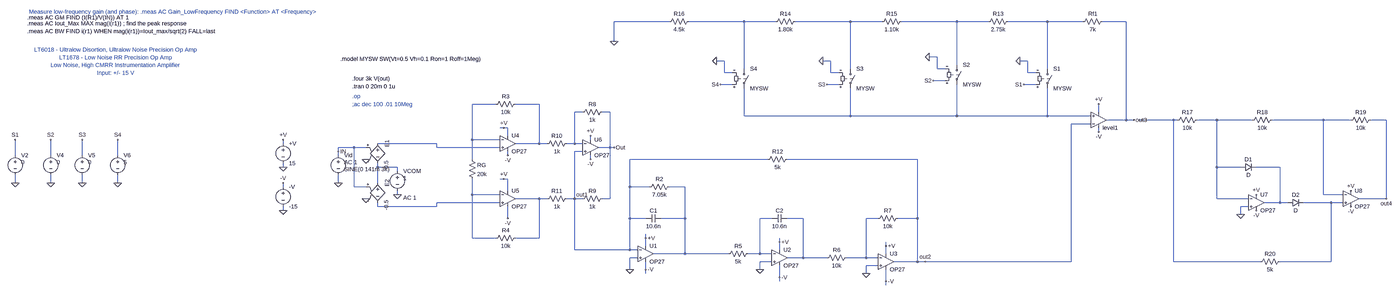
[diagram p0: schematic 1-2-3-4.asc, whole sheet]
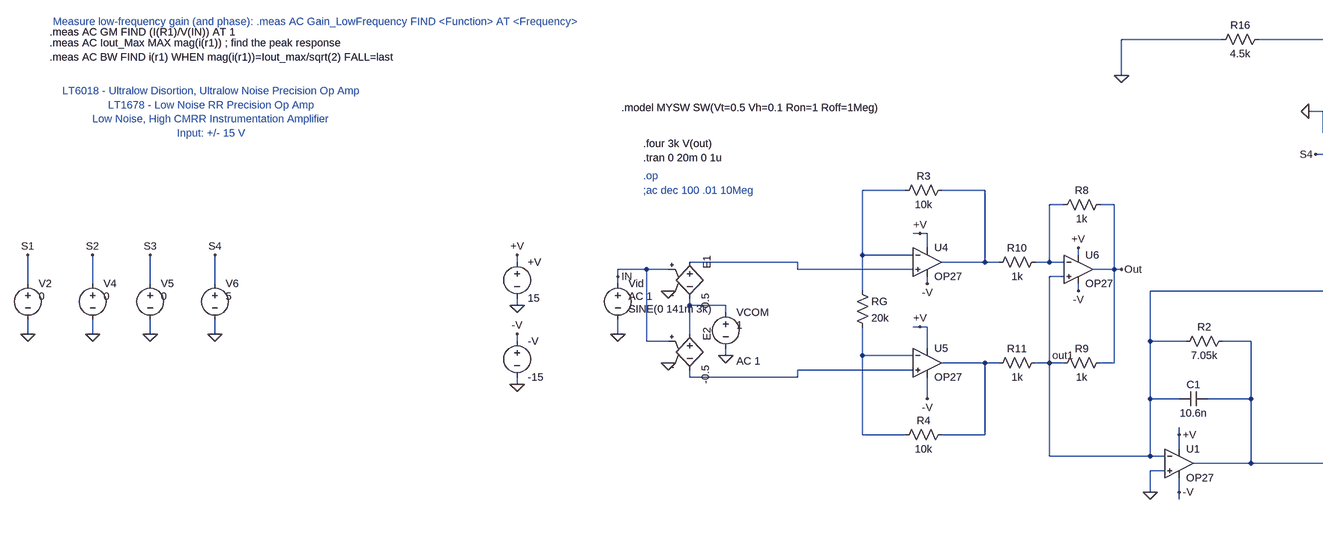
[diagram p1: schematic 1-2-3-4.asc, part, row 1 of 1, column 1 of 2]
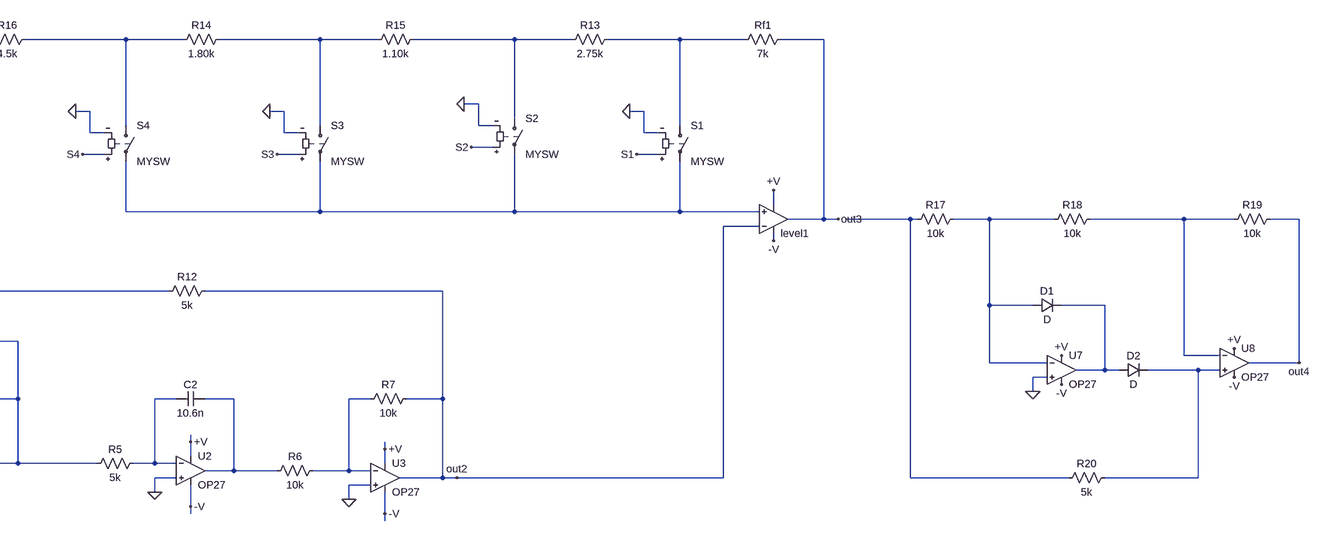
[diagram p2: schematic 1-2-3-4.asc, part, row 1 of 1, column 2 of 2]
1-2-3-4.asc, the LTspice schematic file:
Version 4.1
SHEET 1 4316 1204
WIRE 1120 -288 896 -288
WIRE 1424 -288 1200 -288
WIRE 1552 -288 1424 -288
WIRE 1856 -288 1632 -288
WIRE 1984 -288 1856 -288
WIRE 2288 -288 2064 -288
WIRE 2416 -288 2288 -288
WIRE 2656 -288 2496 -288
WIRE 2800 -288 2656 -288
WIRE 2976 -288 2880 -288
WIRE 896 -208 896 -288
WIRE 2208 -144 2176 -144
WIRE 1344 -128 1312 -128
WIRE 1776 -128 1744 -128
WIRE 2576 -128 2544 -128
WIRE 2288 -112 2288 -288
WIRE 1424 -96 1424 -288
WIRE 1856 -96 1856 -288
WIRE 2208 -96 2208 -144
WIRE 2240 -96 2208 -96
WIRE 2656 -96 2656 -288
WIRE 1344 -80 1344 -128
WIRE 1376 -80 1344 -80
WIRE 1776 -80 1776 -128
WIRE 1808 -80 1776 -80
WIRE 2576 -80 2576 -128
WIRE 2608 -80 2576 -80
WIRE 2240 -48 2192 -48
WIRE 1376 -32 1328 -32
WIRE 1808 -32 1760 -32
WIRE 2608 -32 2560 -32
WIRE 416 48 320 48
WIRE 592 48 496 48
WIRE 768 80 736 80
WIRE 880 80 848 80
WIRE 2864 80 2864 48
WIRE 1424 96 1424 -16
WIRE 1856 96 1856 -16
WIRE 1856 96 1424 96
WIRE 2288 96 2288 -32
WIRE 2288 96 1856 96
WIRE 2656 96 2656 -16
WIRE 2656 96 2288 96
WIRE 2832 96 2656 96
WIRE 2976 112 2976 -288
WIRE 2976 112 2896 112
WIRE 3008 112 2976 112
WIRE 3360 112 3024 112
WIRE 3376 112 3360 112
WIRE 3536 112 3456 112
WIRE 3680 112 3536 112
WIRE 3968 112 3760 112
WIRE 4080 112 3968 112
WIRE 4224 112 4160 112
WIRE 2832 128 2752 128
WIRE 448 144 432 144
WIRE 464 144 448 144
WIRE 2864 160 2864 144
WIRE 464 176 464 144
WIRE 320 192 320 48
WIRE 432 192 320 192
WIRE 800 192 800 176
WIRE -448 208 -448 192
WIRE 176 208 -64 208
WIRE 592 208 592 48
WIRE 592 208 496 208
WIRE 624 208 592 208
WIRE 736 208 736 80
WIRE 736 208 704 208
WIRE 768 208 736 208
WIRE -160 224 -224 224
WIRE -112 224 -160 224
WIRE 176 224 176 208
WIRE 432 224 176 224
WIRE 880 224 880 80
WIRE 880 224 832 224
WIRE 896 224 880 224
WIRE -224 240 -224 224
WIRE 768 240 736 240
WIRE -1536 256 -1536 192
WIRE -1392 256 -1392 192
WIRE -1264 256 -1264 192
WIRE -1120 256 -1120 192
WIRE -224 256 -224 240
WIRE 464 256 464 240
WIRE 320 272 320 192
WIRE 800 272 800 256
WIRE 1520 272 960 272
WIRE 2128 272 1600 272
WIRE -448 304 -448 288
WIRE -64 304 -64 288
WIRE 16 304 -64 304
WIRE 3536 304 3536 112
WIRE 3632 304 3536 304
WIRE 3792 304 3696 304
WIRE 16 320 16 304
WIRE 448 352 432 352
WIRE 464 352 448 352
WIRE -1536 368 -1536 336
WIRE -1392 368 -1392 336
WIRE -1264 368 -1264 336
WIRE -1120 368 -1120 336
WIRE -224 368 -224 336
WIRE -64 368 -64 304
WIRE -448 384 -448 368
WIRE -160 384 -160 224
WIRE -112 384 -160 384
WIRE 960 384 960 272
WIRE 1040 384 960 384
WIRE 1184 384 1120 384
WIRE 464 400 464 352
WIRE 16 416 16 400
WIRE 320 416 320 352
WIRE 432 416 320 416
WIRE 3968 416 3968 112
WIRE 4048 416 3968 416
WIRE 592 432 496 432
WIRE 624 432 592 432
WIRE 736 432 736 240
WIRE 736 432 704 432
WIRE 768 432 736 432
WIRE 880 432 880 224
WIRE 880 432 848 432
WIRE 3536 432 3536 304
WIRE 3664 432 3536 432
WIRE 4224 432 4224 112
WIRE 4224 432 4112 432
WIRE 432 448 176 448
WIRE 3792 448 3792 304
WIRE 3792 448 3728 448
WIRE 3824 448 3792 448
WIRE 4000 448 3888 448
WIRE 4048 448 4000 448
WIRE -64 464 -64 448
WIRE 176 464 176 448
WIRE 176 464 -64 464
WIRE 3664 464 3632 464
WIRE -448 480 -448 464
WIRE 3632 496 3632 464
WIRE 464 512 464 464
WIRE 960 512 960 384
WIRE 1024 512 960 512
WIRE 1184 512 1184 384
WIRE 1184 512 1088 512
WIRE 1536 512 1488 512
WIRE 1664 512 1600 512
WIRE 1968 512 1920 512
WIRE 2128 512 2128 272
WIRE 2128 512 2048 512
WIRE 320 592 320 416
WIRE 416 592 320 592
WIRE 592 592 592 432
WIRE 592 592 496 592
WIRE 1024 592 1024 576
WIRE 1568 608 1568 592
WIRE 1024 624 1024 592
WIRE 2000 624 2000 608
WIRE 736 640 736 432
WIRE 960 640 960 512
WIRE 960 640 736 640
WIRE 992 640 960 640
WIRE 1568 640 1568 608
WIRE 1184 656 1184 512
WIRE 1184 656 1056 656
WIRE 1360 656 1184 656
WIRE 1488 656 1488 512
WIRE 1488 656 1440 656
WIRE 1536 656 1488 656
WIRE 2000 656 2000 624
WIRE 992 672 960 672
WIRE 1664 672 1664 512
WIRE 1664 672 1600 672
WIRE 1760 672 1664 672
WIRE 1920 672 1920 512
WIRE 1920 672 1840 672
WIRE 1968 672 1920 672
WIRE 1536 688 1488 688
WIRE 2128 688 2128 512
WIRE 2128 688 2032 688
WIRE 2160 688 2128 688
WIRE 2752 688 2752 128
WIRE 2752 688 2160 688
WIRE 3360 688 3360 112
WIRE 3712 688 3360 688
WIRE 4000 688 4000 448
WIRE 4000 688 3792 688
WIRE 1968 704 1920 704
WIRE 960 720 960 672
WIRE 1024 720 1024 688
WIRE 1488 720 1488 688
WIRE 1024 736 1024 720
WIRE 1920 736 1920 704
WIRE 1568 752 1568 704
WIRE 1568 768 1568 752
WIRE 2000 768 2000 720
WIRE 2000 784 2000 768
FLAG -448 304 0
FLAG -448 480 0
FLAG -448 192 +V
FLAG -448 368 -V
FLAG 448 144 +V
FLAG 16 416 0
FLAG 464 512 -V
FLAG 896 224 Out
FLAG 800 176 +V
FLAG 800 272 -V
FLAG 448 352 +V
FLAG 464 256 -V
FLAG -224 240 IN
FLAG -224 368 0
FLAG -112 272 0
FLAG -112 432 0
FLAG 736 432 out1
FLAG 960 720 0
FLAG 1488 720 0
FLAG 1920 736 0
FLAG 1024 592 +V
FLAG 1568 608 +V
FLAG 2000 624 +V
FLAG 1024 720 -V
FLAG 1568 752 -V
FLAG 2000 768 -V
FLAG 2160 688 out2
FLAG 3008 112 out3
FLAG 2864 160 -V
FLAG 2864 48 +V
FLAG 896 -208 0
FLAG 2560 -32 S1
FLAG 2544 -128 0
FLAG 2192 -48 S2
FLAG 2176 -144 0
FLAG 1760 -32 S3
FLAG 1744 -128 0
FLAG 1328 -32 S4
FLAG 1312 -128 0
FLAG 3696 480 -V
FLAG 3696 416 +V
FLAG 4080 464 -V
FLAG 4080 400 +V
FLAG 4224 432 out4
FLAG 3632 496 0
FLAG -1536 368 0
FLAG -1536 192 S1
FLAG -1392 368 0
FLAG -1392 192 S2
FLAG -1264 368 0
FLAG -1264 192 S3
FLAG -1120 368 0
FLAG -1120 192 S4
DATAFLAG 320 192 ""
DATAFLAG 592 208 ""
DATAFLAG 592 432 ""
DATAFLAG 880 224 ""
DATAFLAG 2128 688 ""
DATAFLAG 2976 112 ""
DATAFLAG 4224 432 ""
DATAFLAG 960 640 ""
DATAFLAG 736 208 ""
DATAFLAG 736 432 ""
SYMBOL voltage -448 192 R0
WINDOW 123 24 124 Left 2
WINDOW 39 0 0 Left 2
SYMATTR InstName +V
SYMATTR Value 15
SYMBOL voltage -448 368 R0
WINDOW 123 0 0 Left 2
WINDOW 39 0 0 Left 2
SYMATTR InstName -V
SYMATTR Value -15
SYMBOL voltage -224 240 R0
WINDOW 123 24 44 Left 2
WINDOW 39 24 117 Left 2
WINDOW 3 24 72 Left 2
SYMATTR Value2 AC 1
SYMATTR Value SINE(0 141m 3k)
SYMATTR InstName Vid
SYMBOL res 864 64 R90
WINDOW 0 0 56 VBottom 2
WINDOW 3 32 56 VTop 2
SYMATTR InstName R8
SYMATTR Value 1k
SYMATTR SpiceLine tol=1 pwr=0.1
SYMBOL res 864 416 R90
WINDOW 0 0 56 VBottom 2
WINDOW 3 32 56 VTop 2
SYMATTR InstName R9
SYMATTR Value 1k
SYMATTR SpiceLine tol=1 pwr=0.1
SYMBOL res 720 192 R90
WINDOW 0 0 56 VBottom 2
WINDOW 3 32 56 VTop 2
SYMATTR InstName R10
SYMATTR Value 1k
SYMATTR SpiceLine tol=1 pwr=0.1
SYMBOL res 720 416 R90
WINDOW 0 0 56 VBottom 2
WINDOW 3 32 56 VTop 2
SYMATTR InstName R11
SYMATTR Value 1k
SYMATTR SpiceLine tol=1 pwr=0.1
SYMBOL res 304 256 R0
SYMATTR InstName RG
SYMATTR Value 20k
SYMATTR SpiceLine tol=1 pwr=0.1
SYMBOL res 512 32 R90
WINDOW 0 0 56 VBottom 2
WINDOW 3 32 56 VTop 2
SYMATTR InstName R3
SYMATTR Value 10k
SYMATTR SpiceLine tol=1 pwr=0.1
SYMBOL res 512 576 R90
WINDOW 0 0 56 VBottom 2
WINDOW 3 32 56 VTop 2
SYMATTR InstName R4
SYMATTR Value 10k
SYMATTR SpiceLine tol=1 pwr=0.1
SYMBOL voltage 16 304 R0
WINDOW 123 24 124 Left 2
WINDOW 39 24 117 Left 2
WINDOW 3 24 44 Left 2
SYMATTR Value2 AC 1
SYMATTR Value 1
SYMATTR InstName VCOM
SYMBOL e -64 192 R0
WINDOW 0 39 1 VRight 2
WINDOW 3 35 85 VRight 2
SYMATTR InstName E1
SYMATTR Value 0.5
SYMBOL e -64 352 R0
WINDOW 0 39 1 VRight 2
WINDOW 3 35 85 VRight 2
SYMATTR InstName E2
SYMATTR Value -0.5
SYMBOL OpAmps\\OP27 464 144 R0
SYMATTR InstName U4
SYMBOL OpAmps\\OP27 464 368 R0
SYMATTR InstName U5
SYMBOL OpAmps\\OP27 800 160 R0
SYMATTR InstName U6
SYMBOL res 1136 368 R90
WINDOW 0 0 56 VBottom 2
WINDOW 3 32 56 VTop 2
SYMATTR InstName R2
SYMATTR Value 7.05k
SYMBOL res 1456 640 R90
WINDOW 0 0 56 VBottom 2
WINDOW 3 32 56 VTop 2
SYMATTR InstName R5
SYMATTR Value 5k
SYMBOL res 1856 656 R90
WINDOW 0 0 56 VBottom 2
WINDOW 3 32 56 VTop 2
SYMATTR InstName R6
SYMATTR Value 10k
SYMBOL res 2064 496 R90
WINDOW 0 0 56 VBottom 2
WINDOW 3 32 56 VTop 2
SYMATTR InstName R7
SYMATTR Value 10k
SYMBOL cap 1088 496 R90
WINDOW 0 0 32 VBottom 2
WINDOW 3 32 32 VTop 2
SYMATTR InstName C1
SYMATTR Value 10.6n
SYMBOL cap 1600 496 R90
WINDOW 0 0 32 VBottom 2
WINDOW 3 32 32 VTop 2
SYMATTR InstName C2
SYMATTR Value 10.6n
SYMBOL res 1616 256 R90
WINDOW 0 0 56 VBottom 2
WINDOW 3 32 56 VTop 2
SYMATTR InstName R12
SYMATTR Value 5k
SYMBOL OpAmps\\OP27 1024 592 R0
SYMATTR InstName U1
SYMBOL OpAmps\\OP27 1568 608 R0
SYMATTR InstName U2
SYMBOL OpAmps\\OP27 2000 624 R0
SYMATTR InstName U3
SYMBOL res 2400 -272 R270
WINDOW 0 32 56 VTop 2
WINDOW 3 0 56 VBottom 2
SYMATTR InstName R13
SYMATTR Value 2.75k
SYMBOL res 2896 -304 R90
WINDOW 0 0 56 VBottom 2
WINDOW 3 32 56 VTop 2
SYMATTR InstName Rf1
SYMATTR Value 7k
SYMBOL res 1536 -272 R270
WINDOW 0 32 56 VTop 2
WINDOW 3 0 56 VBottom 2
SYMATTR InstName R14
SYMATTR Value 1.80k
SYMBOL res 1968 -272 R270
WINDOW 0 32 56 VTop 2
WINDOW 3 0 56 VBottom 2
SYMATTR InstName R15
SYMATTR Value 1.10k
SYMBOL res 1104 -272 R270
WINDOW 0 32 56 VTop 2
WINDOW 3 0 56 VBottom 2
SYMATTR InstName R16
SYMATTR Value 4.5k
SYMBOL sw 2656 -112 R0
SYMATTR InstName S1
SYMATTR Value MYSW
SYMBOL sw 2288 -128 R0
SYMATTR InstName S2
SYMATTR Value MYSW
SYMBOL sw 1856 -112 R0
SYMATTR InstName S3
SYMATTR Value MYSW
SYMBOL sw 1424 -112 R0
SYMATTR InstName S4
SYMATTR Value MYSW
SYMBOL OpAmps\\UniversalOpAmp1 2864 112 M180
SYMATTR InstName level1
SYMATTR Value2 Avol=1Meg GBW=100Meg Vos=0
SYMBOL diode 3632 320 R270
WINDOW 0 32 32 VTop 2
WINDOW 3 0 32 VBottom 2
SYMATTR InstName D1
SYMBOL diode 3824 464 R270
WINDOW 0 32 32 VTop 2
WINDOW 3 0 32 VBottom 2
SYMATTR InstName D2
SYMBOL OpAmps\\OP27 3696 384 R0
SYMATTR InstName U7
SYMBOL OpAmps\\OP27 4080 368 R0
SYMATTR InstName U8
SYMBOL res 3472 96 R90
WINDOW 0 0 56 VBottom 2
WINDOW 3 32 56 VTop 2
SYMATTR InstName R17
SYMATTR Value 10k
SYMBOL res 3776 96 R90
WINDOW 0 0 56 VBottom 2
WINDOW 3 32 56 VTop 2
SYMATTR InstName R18
SYMATTR Value 10k
SYMBOL res 4176 96 R90
WINDOW 0 0 56 VBottom 2
WINDOW 3 32 56 VTop 2
SYMATTR InstName R19
SYMATTR Value 10k
SYMBOL res 3808 672 R90
WINDOW 0 0 56 VBottom 2
WINDOW 3 32 56 VTop 2
SYMATTR InstName R20
SYMATTR Value 5k
SYMBOL voltage -1536 240 R0
WINDOW 123 0 0 Left 2
WINDOW 39 0 0 Left 2
WINDOW 3 24 44 Left 2
SYMATTR Value 0
SYMATTR InstName V2
SYMBOL voltage -1392 240 R0
WINDOW 123 0 0 Left 2
WINDOW 39 0 0 Left 2
WINDOW 3 24 44 Left 2
SYMATTR Value 0
SYMATTR InstName V4
SYMBOL voltage -1264 240 R0
WINDOW 123 0 0 Left 2
WINDOW 39 0 0 Left 2
WINDOW 3 24 44 Left 2
SYMATTR Value 0
SYMATTR InstName V5
SYMBOL voltage -1120 240 R0
WINDOW 123 24 44 Left 2
WINDOW 39 0 0 Left 2
WINDOW 3 24 44 Left 2
SYMATTR Value 5
SYMATTR InstName V6
TEXT -1128 -64 Bottom 2 ;LT6018 - Ultralow Disortion, Ultralow Noise Precision Op Amp\nLT1678 - Low Noise RR Precision Op Amp\nLow Noise, High CMRR Instrumentation Amplifier\nInput: +/- 15 V
TEXT -168 48 Left 2 ;;ac dec 100 .01 10Meg
TEXT -1488 -304 Left 2 !.meas AC GM FIND (I(R1)/V(IN)) AT 1
TEXT -1480 -328 Left 2 ;Measure low-frequency gain (and phase): .meas AC Gain_LowFrequency FIND <Function> AT <Frequency>
TEXT -1488 -280 Left 2 !.meas AC Iout_Max MAX mag(i(r1)) ; find the peak response\n.meas AC BW FIND i(r1) WHEN mag(i(r1))=Iout_max/sqrt(2) FALL=last
TEXT -168 16 Left 2 ;.op
TEXT -168 -24 Left 2 !.tran 0 20m 0 1u
TEXT -168 -56 Left 2 !.four 3k V(out)
TEXT -216 -136 Left 2 !.model MYSW SW(Vt=0.5 Vh=0.1 Ron=1 Roff=1Meg)

The netlist it stands for:
* 1-2-3-4.asc
V§+V +V 0 15
V§-V -V 0 -15
Vid IN 0 SINE(0 141m 3k) AC 1
R8 Out N007 1k tol=1 pwr=0.1
R9 Out out1 1k tol=1 pwr=0.1
R10 N007 N006 1k tol=1 pwr=0.1
R11 out1 N017 1k tol=1 pwr=0.1
RG N005 N016 20k tol=1 pwr=0.1
R3 N006 N005 10k tol=1 pwr=0.1
R4 N017 N016 10k tol=1 pwr=0.1
VCOM N013 0 1 AC 1
E1 N012 N013 IN 0 0.5
E2 N013 N018 IN 0 -0.5
X§U4 N012 N005 +V -V N006 OP27  ; pins In+ In- V+ V- OUT
X§U5 N018 N016 +V -V N017 OP27  ; pins In+ In- V+ V- OUT
X§U6 out1 N007 +V -V Out OP27  ; pins In+ In- V+ V- OUT
R2 N015 out1 7.05k
R5 N020 N015 5k
R6 N022 N021 10k
R7 out2 N022 10k
C1 N015 out1 10.6n
C2 N021 N020 10.6n
R12 out2 out1 5k
X§U1 0 out1 +V -V N015 OP27  ; pins In+ In- V+ V- OUT
X§U2 0 N020 +V -V N021 OP27  ; pins In+ In- V+ V- OUT
X§U3 0 N022 +V -V out2 OP27  ; pins In+ In- V+ V- OUT
R13 N003 N004 2.75k
Rf1 out3 N004 7k
R14 N001 N002 1.80k
R15 N002 N003 1.10k
R16 0 N001 4.5k
S1 N004 N008 S1 0 MYSW
S2 N003 N008 S2 0 MYSW
S3 N002 N008 S3 0 MYSW
S4 N001 N008 S4 0 MYSW
X§level1 N008 out2 -V +V out3 level1 Avol=1Meg GBW=100Meg Vos=0 En=0 Enk=0 In=0 Ink=0 Rin=500Meg  ; pins In+ In- V+ V- OUT
D1 N010 N014 D
D2 N014 N019 D
X§U7 0 N010 +V -V N014 OP27  ; pins In+ In- V+ V- OUT
X§U8 N019 N011 +V -V out4 OP27  ; pins In+ In- V+ V- OUT
R17 N010 N009 10k
R18 N011 N010 10k
R19 out4 N011 10k
R20 N019 N009 5k
V2 S1 0 0
V4 S2 0 0
V5 S3 0 0
V6 S4 0 5
.model D D
.lib standard.dio
* LT6018 - Ultralow Disortion, Ultralow Noise Precision Op Amp
* LT1678 - Low Noise RR Precision Op Amp
* Low Noise, High CMRR Instrumentation Amplifier
* Input: +/- 15 V
* ;ac dec 100 .01 10Meg
.meas AC GM FIND (I(R1)/V(IN)) AT 1
* Measure low-frequency gain (and phase): .meas AC Gain_LowFrequency FIND <Function> AT <Frequency>
.meas AC Iout_Max MAX mag(i(r1)) ; find the peak response
.meas AC BW FIND i(r1) WHEN mag(i(r1))=Iout_max/sqrt(2) FALL=last
* .op
.tran 0 20m 0 1u
.four 3k V(out)
.model MYSW SW(Vt=0.5 Vh=0.1 Ron=1 Roff=1Meg)
.lib ADI.lib
.lib UniversalOpAmp1.lib
.backanno
.end